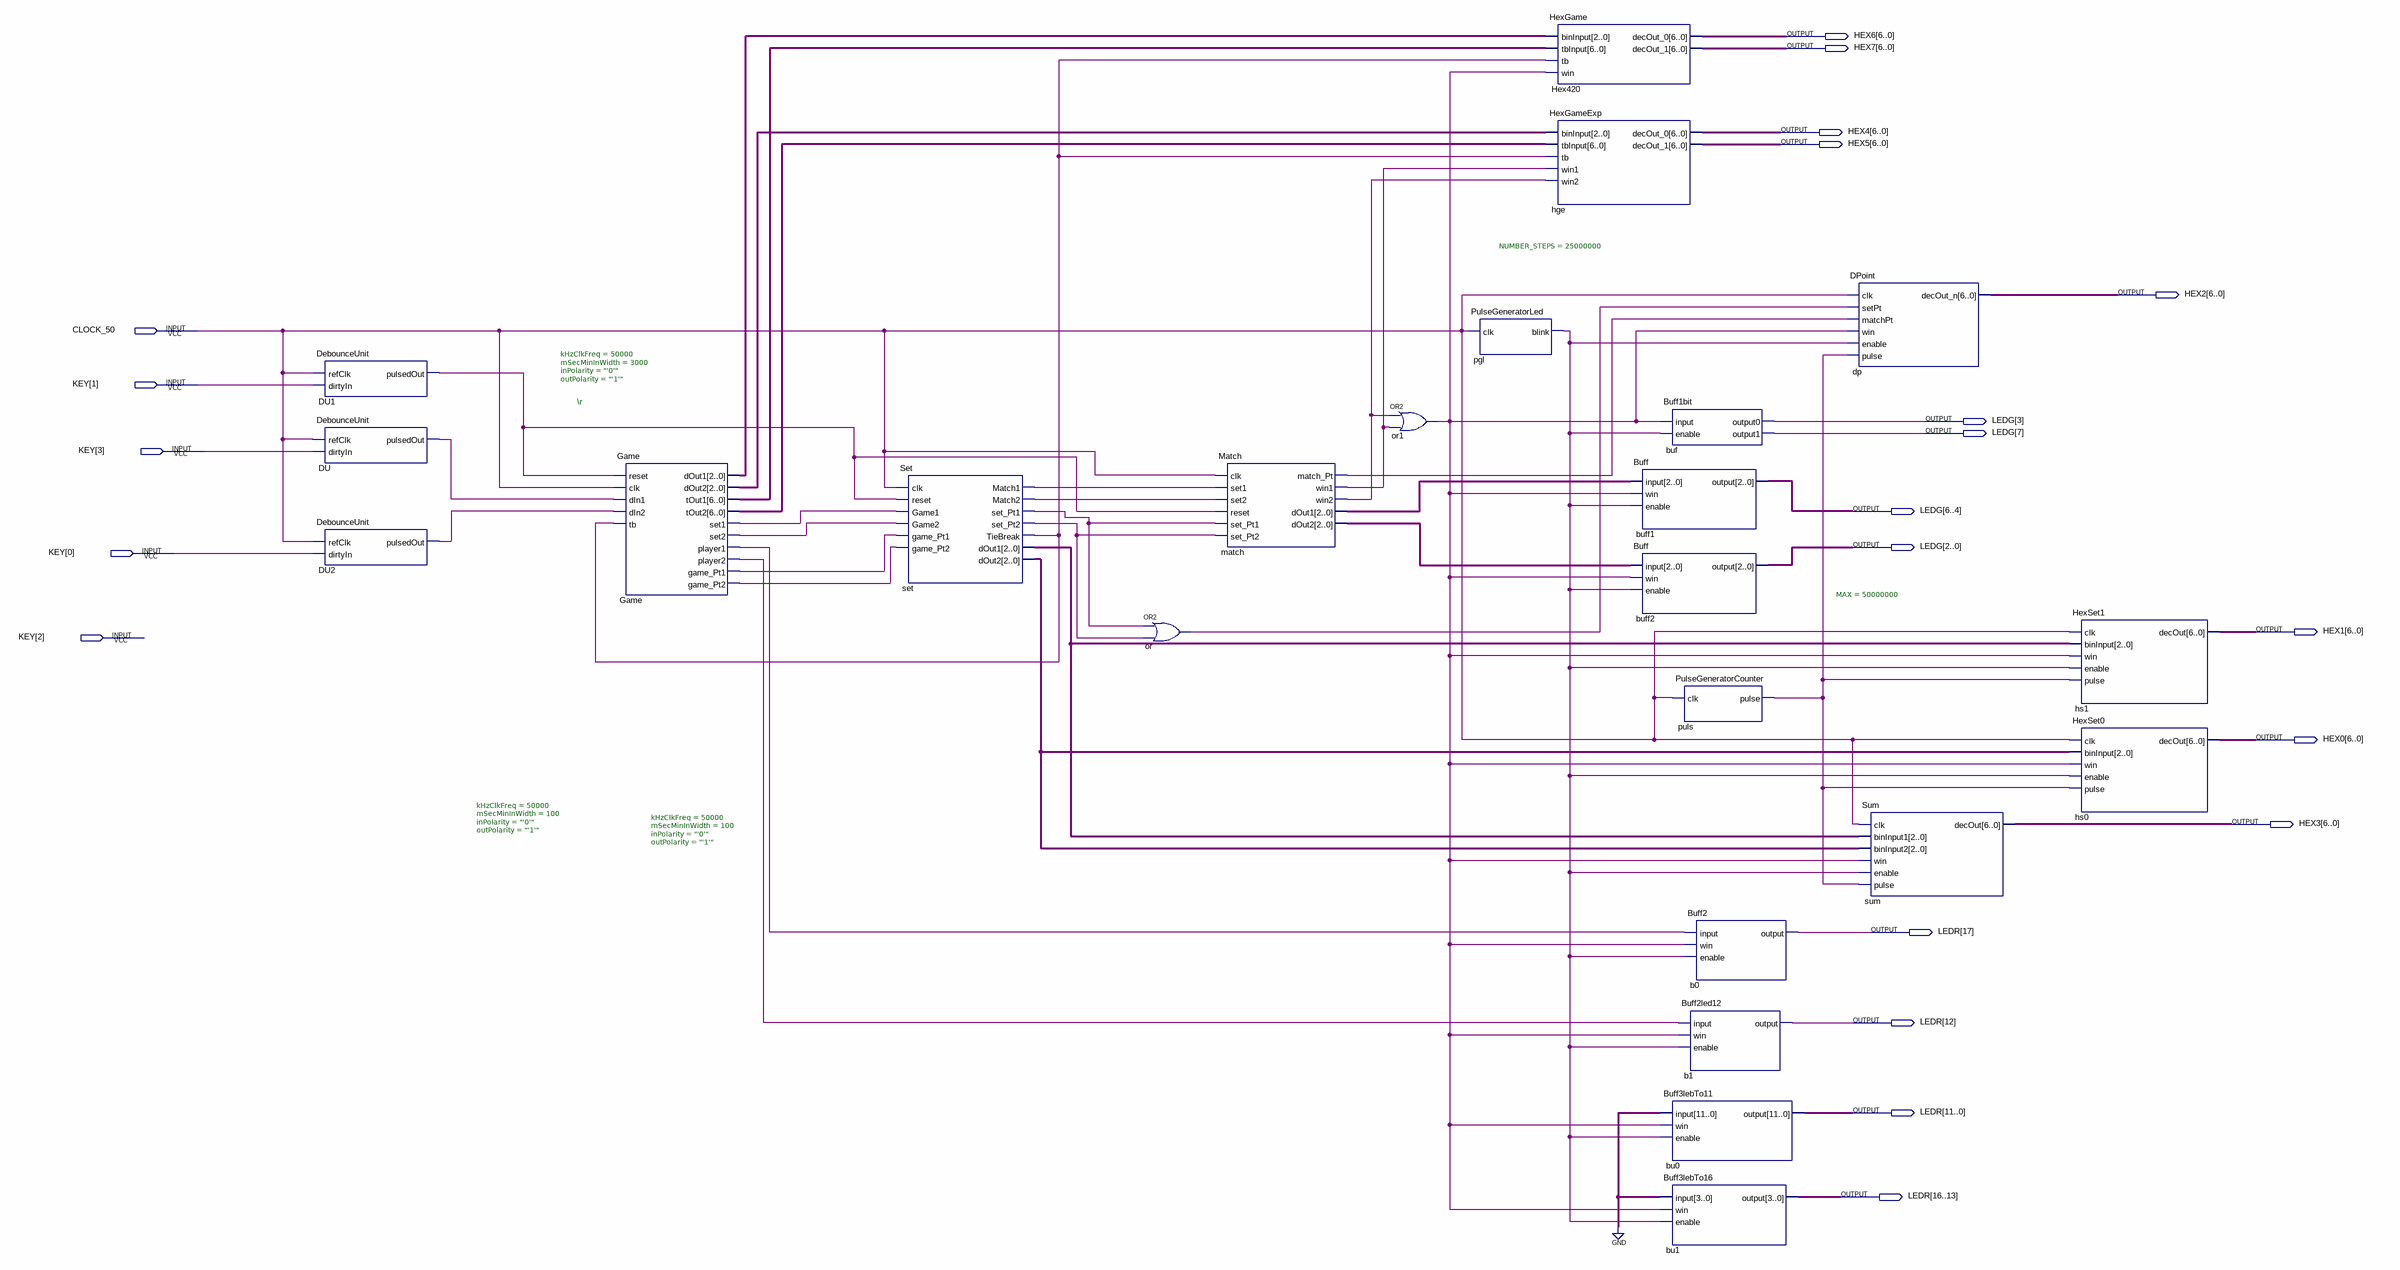
[diagram p0: schematic sheet]
// Quartus schematic Tenis_Demo.bdf as structural Verilog: 23 symbols, 21 pins
module Tenis_Demo (
  input  CLOCK_50,
  input  [3:0] KEY,
  output [6:0] HEX6,
  output [6:0] HEX7,
  output [6:0] HEX4,
  output [6:0] HEX5,
  output [6:0] HEX2,
  output [7:0] LEDG,
  output [6:0] HEX1,
  output [6:0] HEX0,
  output [6:0] HEX3,
  output [17:0] LEDR
);

  wire DU1_pulsedout, DU2_pulsedout, DU_pulsedout, Game_game_pt1, Game_game_pt2, Game_player1, Game_player2,
       Game_set1, Game_set2, match_match_pt, match_win1, match_win2, or1_out, or_out, pgl_blink, puls_pulse,
       set_match1, set_match2, set_set_pt1, set_set_pt2, set_tiebreak;
  wire [2:0] Game_dout1, Game_dout2, match_dout1, match_dout2, set_dout1, set_dout2;
  wire [6:0] Game_tout1, Game_tout2;

  DebounceUnit #(.kHzClkFreq(50000), .mSecMinInWidth(3000), .inPolarity("'0'"), .outPolarity("'1'")) DU1 (
    .refClk(CLOCK_50), .dirtyIn(KEY[1]), .pulsedOut(DU1_pulsedout));
  DebounceUnit #(.kHzClkFreq(50000), .mSecMinInWidth(100), .inPolarity("'0'"), .outPolarity("'1'")) DU (
    .refClk(CLOCK_50), .dirtyIn(KEY[3]), .pulsedOut(DU_pulsedout));
  DebounceUnit #(.kHzClkFreq(50000), .mSecMinInWidth(100), .inPolarity("'0'"), .outPolarity("'1'")) DU2 (
    .refClk(CLOCK_50), .dirtyIn(KEY[0]), .pulsedOut(DU2_pulsedout));
  Game Game (
    .reset(DU1_pulsedout), .clk(CLOCK_50), .dIn1(DU_pulsedout), .dIn2(DU2_pulsedout), .tb(set_tiebreak),
    .dOut1(Game_dout1), .dOut2(Game_dout2), .tOut1(Game_tout1), .tOut2(Game_tout2), .set1(Game_set1),
    .set2(Game_set2), .player1(Game_player1), .player2(Game_player2), .game_Pt1(Game_game_pt1),
    .game_Pt2(Game_game_pt2));
  Set set (
    .clk(CLOCK_50), .reset(DU1_pulsedout), .Game1(Game_set1), .Game2(Game_set2), .game_Pt1(Game_game_pt1),
    .game_Pt2(Game_game_pt2), .Match1(set_match1), .Match2(set_match2), .set_Pt1(set_set_pt1),
    .set_Pt2(set_set_pt2), .TieBreak(set_tiebreak), .dOut1(set_dout1), .dOut2(set_dout2));
  or \or  (or_out, set_set_pt1, set_set_pt2);
  Match match (
    .clk(CLOCK_50), .set1(set_match1), .set2(set_match2), .reset(DU1_pulsedout), .set_Pt1(set_set_pt1),
    .set_Pt2(set_set_pt2), .match_Pt(match_match_pt), .win1(match_win1), .win2(match_win2),
    .dOut1(match_dout1), .dOut2(match_dout2));
  or or1 (or1_out, match_win2, match_win1);
  PulseGeneratorLed #(.NUMBER_STEPS(25000000)) pgl (.clk(CLOCK_50), .blink(pgl_blink));
  HexGame Hex420 (
    .binInput(Game_dout1), .tbInput(Game_tout1), .tb(set_tiebreak), .win(or1_out), .decOut_0(HEX6),
    .decOut_1(HEX7));
  HexGameExp hge (
    .binInput(Game_dout2), .tbInput(Game_tout2), .tb(set_tiebreak), .win1(match_win1), .win2(match_win2),
    .decOut_0(HEX4), .decOut_1(HEX5));
  Buff buff1 (.\input (match_dout1), .win(or1_out), .enable(pgl_blink), .\output (LEDG[6:4]));
  Buff buff2 (.\input (match_dout2), .win(or1_out), .enable(pgl_blink), .\output (LEDG[2:0]));
  Buff1bit \buf  (.\input (or1_out), .enable(pgl_blink), .output0(LEDG[3]), .output1(LEDG[7]));
  PulseGeneratorCounter #(.MAX(50000000)) puls (.clk(CLOCK_50), .pulse(puls_pulse));
  Buff2 b0 (.\input (Game_player1), .win(or1_out), .enable(pgl_blink), .\output (LEDR[17]));
  Buff2led12 b1 (.\input (Game_player2), .win(or1_out), .enable(pgl_blink), .\output (LEDR[12]));
  Buff3lebTo11 bu0 (.\input ({12{1'b0}}), .win(or1_out), .enable(pgl_blink), .\output (LEDR[11:0]));
  Buff3lebTo16 bu1 (.\input ({12{1'b0}}), .win(or1_out), .enable(pgl_blink), .\output (LEDR[16:13]));
  DPoint dp (
    .clk(CLOCK_50), .setPt(or_out), .matchPt(match_match_pt), .win(or1_out), .enable(pgl_blink),
    .pulse(puls_pulse), .decOut_n(HEX2));
  Sum sum (
    .clk(CLOCK_50), .binInput1(set_dout1), .binInput2(set_dout2), .win(or1_out), .enable(pgl_blink),
    .pulse(puls_pulse), .decOut(HEX3));
  HexSet1 hs1 (
    .clk(CLOCK_50), .binInput(set_dout1), .win(or1_out), .enable(pgl_blink), .pulse(puls_pulse), .decOut(HEX1));
  HexSet0 hs0 (
    .clk(CLOCK_50), .binInput(set_dout2), .win(or1_out), .enable(pgl_blink), .pulse(puls_pulse), .decOut(HEX0));

  // Notes on the sheet:
  //   \r
endmodule
